# Altium project motor-control.PrjPcb
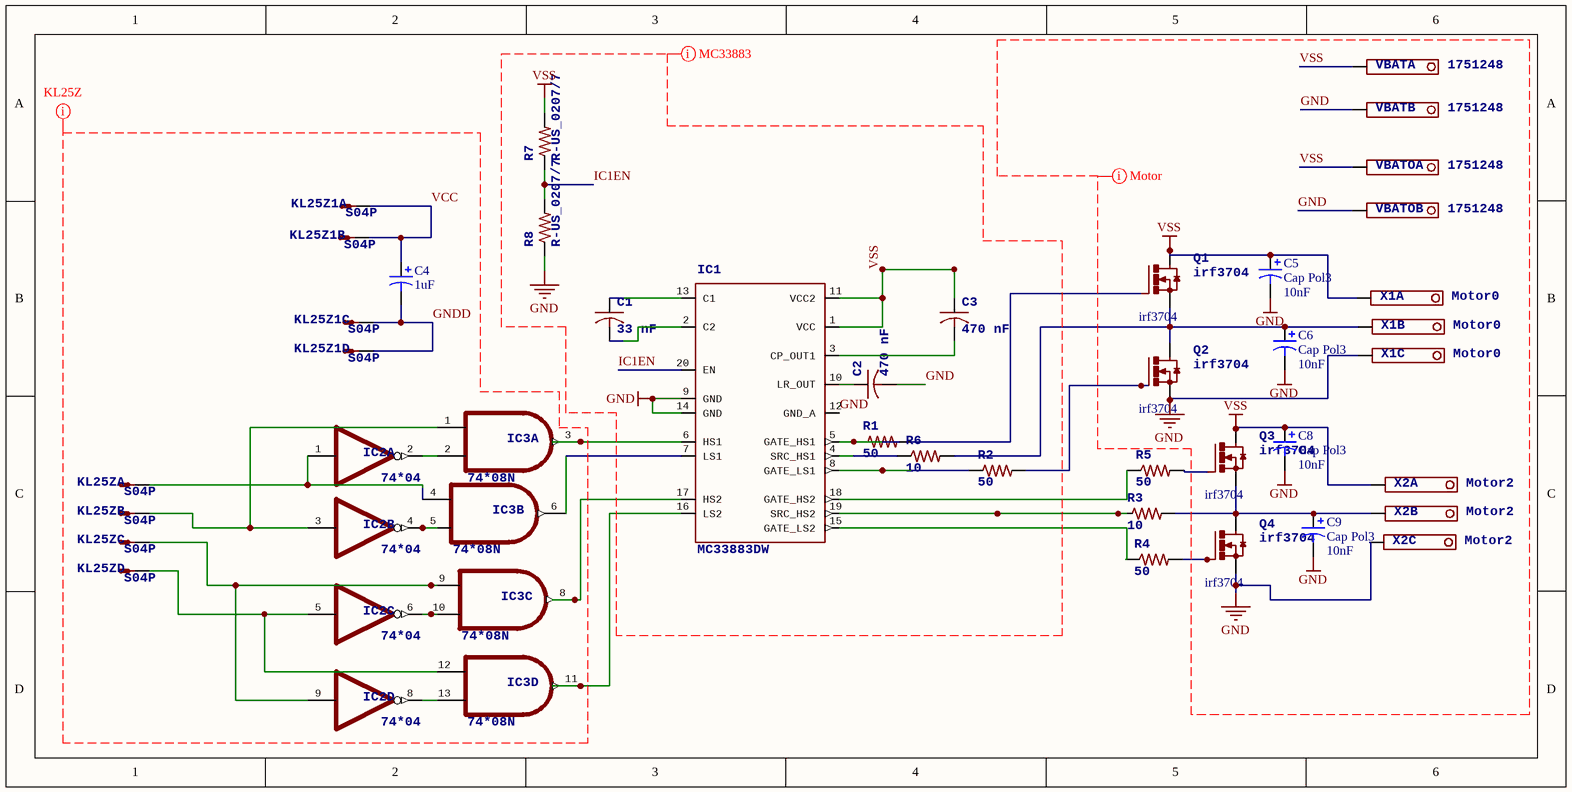
[diagram p0: motor-control.SchDoc]
1 sheet, 29 parts. Net scope: global (net labels, ports and power ports of the same name join across sheets).
Board file: motor_driver.PcbDoc

## Sheet motor-control.SchDoc
size 275 x 138 mm

### Parts
C1  33 nF  [C0805]
C2  470 nF  [C0805]
C3  470 nF  [C0805]
C4  1uF  [C0805]
C5  Cap Pol3  value 10nF  [C0805]
C6  Cap Pol3  value 10nF  [C0805]
C8  Cap Pol3  value 10nF  [C0805]
C9  Cap Pol3  value 10nF  [C0805]
IC1  MC33883DW  [SO20l]
IC2  74*04  [SO14]  (parts A,B,C,D of 7)
IC3  74*08N  [SO14]  (parts A,B,C,D of 5)
KL25Z  S04P  [S04P]  (parts A,B,C,D of 4)
KL25Z1  S04P  [S04P]  (parts A,B,C,D of 4)
Q1  irf3704  [TO220BH]
Q2  irf3704  [TO220BH]
Q3  irf3704  [TO220BH]
Q4  irf3704  [TO220BH]
R1  50  [M0805]
R2  50  [M0805]
R3  10  [M0805]
R4  50  [M0805]
R5  50  [M0805]
R6  10  [M0805]
R7  R-US_0207/7  [0207/7]
R8  R-US_0207/7  [0207/7]
VBAT  1751248  [1751248]  (parts A,B of 2)
VBATO  1751248  [1751248]  (parts A,B of 2)
X1  Motor0  [1751251]  (parts A,B,C of 3)
X2  Motor2  [1751251]  (parts A,B,C of 3)

### Nets
GND: C2.2 C5.2 C6.2 C8.2 C9.2 IC1.9(GND) IC1.12(GND_A) IC1.14(GND) Q2.S Q4.S R8.1 VBAT.2(K) VBATO.2(K) X1.3(K) X2.3(K)
VSS: C3.1 C5.1 C8.1 IC1.1(VCC) IC1.11(VCC2) Q1.D Q3.D R7.2 VBAT.1(K) VBATO.1(K) X1.1(K) X2.1(K)
GNDD: C4.2 KL25Z1.3(S) KL25Z1.4(S)
IC1EN: IC1.20(EN) R7.1 R8.2
VCC: C4.1 KL25Z1.1(S) KL25Z1.2(S)
NetC1_1: C1.1 IC1.13(C1)
NetC1_2: C1.2 IC1.2(C2)
NetC2_1: C2.1 IC1.10(LR_OUT)
NetC3_2: C3.2 IC1.3(CP_OUT1)
NetC6_1: C6.1 Q1.S Q2.D R6.2 X1.2(K)
NetC9_1: C9.1 Q3.S Q4.D R3.2 X2.2(K)
NetIC1_4: IC1.4(SRC_HS1) R6.1
NetIC1_5: IC1.5(GATE_HS1) R1.1
NetIC1_6: IC1.6(HS1) IC3.3(O)
NetIC1_7: IC1.7(LS1) IC3.6(O)
NetIC1_8: IC1.8(GATE_LS1) R2.1
NetIC1_15: IC1.15(GATE_LS2) R4.1
NetIC1_16: IC1.16(LS2) IC3.11(O)
NetIC1_17: IC1.17(HS2) IC3.8(O)
NetIC1_18: IC1.18(GATE_HS2) R5.1
NetIC1_19: IC1.19(SRC_HS2) R3.1
NetIC2_1: IC2.1(I) IC3.4(I0) KL25Z.1(S)
NetIC2_2: IC2.2(O) IC3.2(I1)
NetIC2_3: IC2.3(I) IC3.1(I0) KL25Z.2(S)
NetIC2_4: IC2.4(O) IC3.5(I1)
NetIC2_5: IC2.5(I) IC3.12(I0) KL25Z.4(S)
NetIC2_6: IC2.6(O) IC3.10(I1)
NetIC2_8: IC2.8(O) IC3.13(I1)
NetIC2_9: IC2.9(I) IC3.9(I0) KL25Z.3(S)
NetQ1_G: Q1.G R1.2
NetQ2_G: Q2.G R2.2
NetQ3_G: Q3.G R5.2
NetQ4_G: Q4.G R4.2

### Layout directives
net class Motor: GND, VSS
net class MC33883: GND, IC1EN, VSS
net class KL25Z: GNDD, VCC

### Library data of the parts
C1-C3 = C-USC0805: <B>CAPACITOR</B>, American symbol
C4-C6 C8 C9 = Cap Pol3: Polarized Capacitor (Surface Mount); Published: 8-Jun-2000; LatestRevisionDate: 29-May-2009; LatestRevisionNote: IPC-7351 Footprint Added.; PackageReference: C0805; Publisher: Altium Limited; PackageDescription: Chip Capacitor
IC1 = MC33883DW: <b>Full Bridge Pre-Driver</b> 55V<p> / Source: www.motorola.com/... MC33883.pdf; OC_FARNELL: unknown; OC_NEWARK: unknown
IC2 = 74*04D
IC3 = 74*08D
KL25Z KL25Z1 = S04P: <b>AMP MT CONNECTOR</b>; OC_FARNELL: unknown; OC_NEWARK: unknown
Q1-Q4 = IRF3704-H: ID: irf3704
R1-R6 = R-US_M0805: <B>RESISTOR</B>, American symbol
R7 R8 = R-US_0207/7: <B>RESISTOR</B>, American symbol
VBAT VBATO = 1751248: <b>MKDS 1/ 2-3,5</b> Printklemme<p> / Nennstrom: 10 A<br> / Bemessungsspannung: 160 V<br> / Raster: 3,5 mm<br> / Polzahl: 2<br> / Montageart: Löten<br> / Anschlussart: Schraubanschluss<br> / Anschlussrichtung vom Leiter zur Platine: 0°<br> / Source: http://eshop.phoenixcontact.com .. 1751248.pdf; OC_FARNELL: unknown; OC_NEWARK: unknown
X1 X2 = 1751251: OC_FARNELL: unknown; OC_NEWARK: unknown